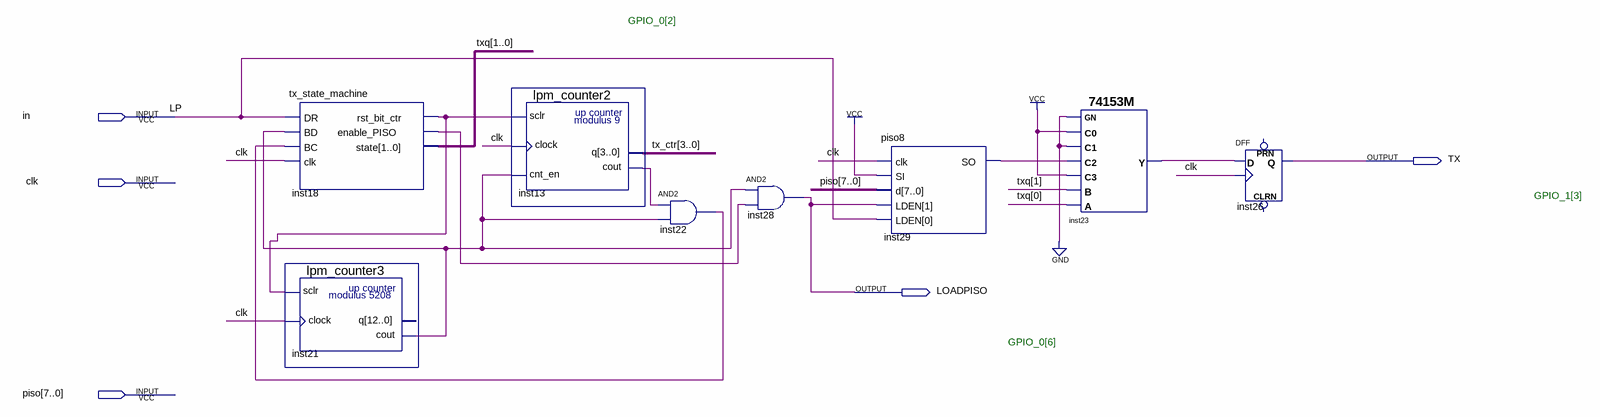
[diagram p0: schematic sheet]
// Quartus schematic uart.bdf as structural Verilog: 8 symbols, 5 pins
module uart (
  input  in,
  input  clk,
  input  [7:0] piso,
  output TX,
  output LOADPISO
);

  wire inst13_cout, inst18_enable_piso, inst18_rst_bit_ctr, inst21_cout, inst22_out, inst23_y, inst29_so;
  wire [1:0] txq;
  wire [3:0] tx_ctr;

  tx_state_machine inst18 (
    .DR(in), .BD(inst21_cout), .BC(inst22_out), .clk(clk), .rst_bit_ctr(inst18_rst_bit_ctr),
    .enable_PISO(inst18_enable_piso), .state(txq));
  lpm_counter3 inst21 (.sclr(inst18_rst_bit_ctr), .clock(clk), .cout(inst21_cout));  // open: q
  lpm_counter2 inst13 (.sclr(inst18_rst_bit_ctr), .clock(clk), .cnt_en(inst21_cout), .cout(inst13_cout), .q(tx_ctr));
  and inst22 (inst22_out, inst13_cout, inst21_cout);
  and inst28 (LOADPISO, inst21_cout, inst18_enable_piso);
  piso8 inst29 (.clk(clk), .SI(1'b1), .d(piso), .LDEN({LOADPISO, in}), .SO(inst29_so));
  \74153M  inst23 (.A(txq[0]), .B(txq[1]), .C3(1'b1), .C2(inst29_so), .C1(1'b0), .C0(1'b1), .GN(1'b0), .Y(inst23_y));
  DFF inst26 (.CLK(clk), .D(inst23_y), .Q(TX));  // open: CLRN, PRN

  // Other names for the same wires on the sheet: LP = in

  // Notes on the sheet:
  //   GPIO_0[2]
  //   GPIO_1[3]
  //   GPIO_0[6]
endmodule
